# Altium schematic sheet OpenBMS.SchDoc: OpenBMS Parent schematic
size 299 x 420 mm; Title2: OpenBMS; Project: OpenBMS; DSN_APP_DATE: --/--/--; CHK_APP_DATE: --/--/--; ApprovedBy: 1; CheckedBy: 1; Author: Kayoum Djedidi; CompanyName: ISIMM; DrawnBy: Kayoum Djedidi; DocumentNumber: 1; Revision: 0; SheetNumber: 1; SheetTotal: 5; ImagePath: 1
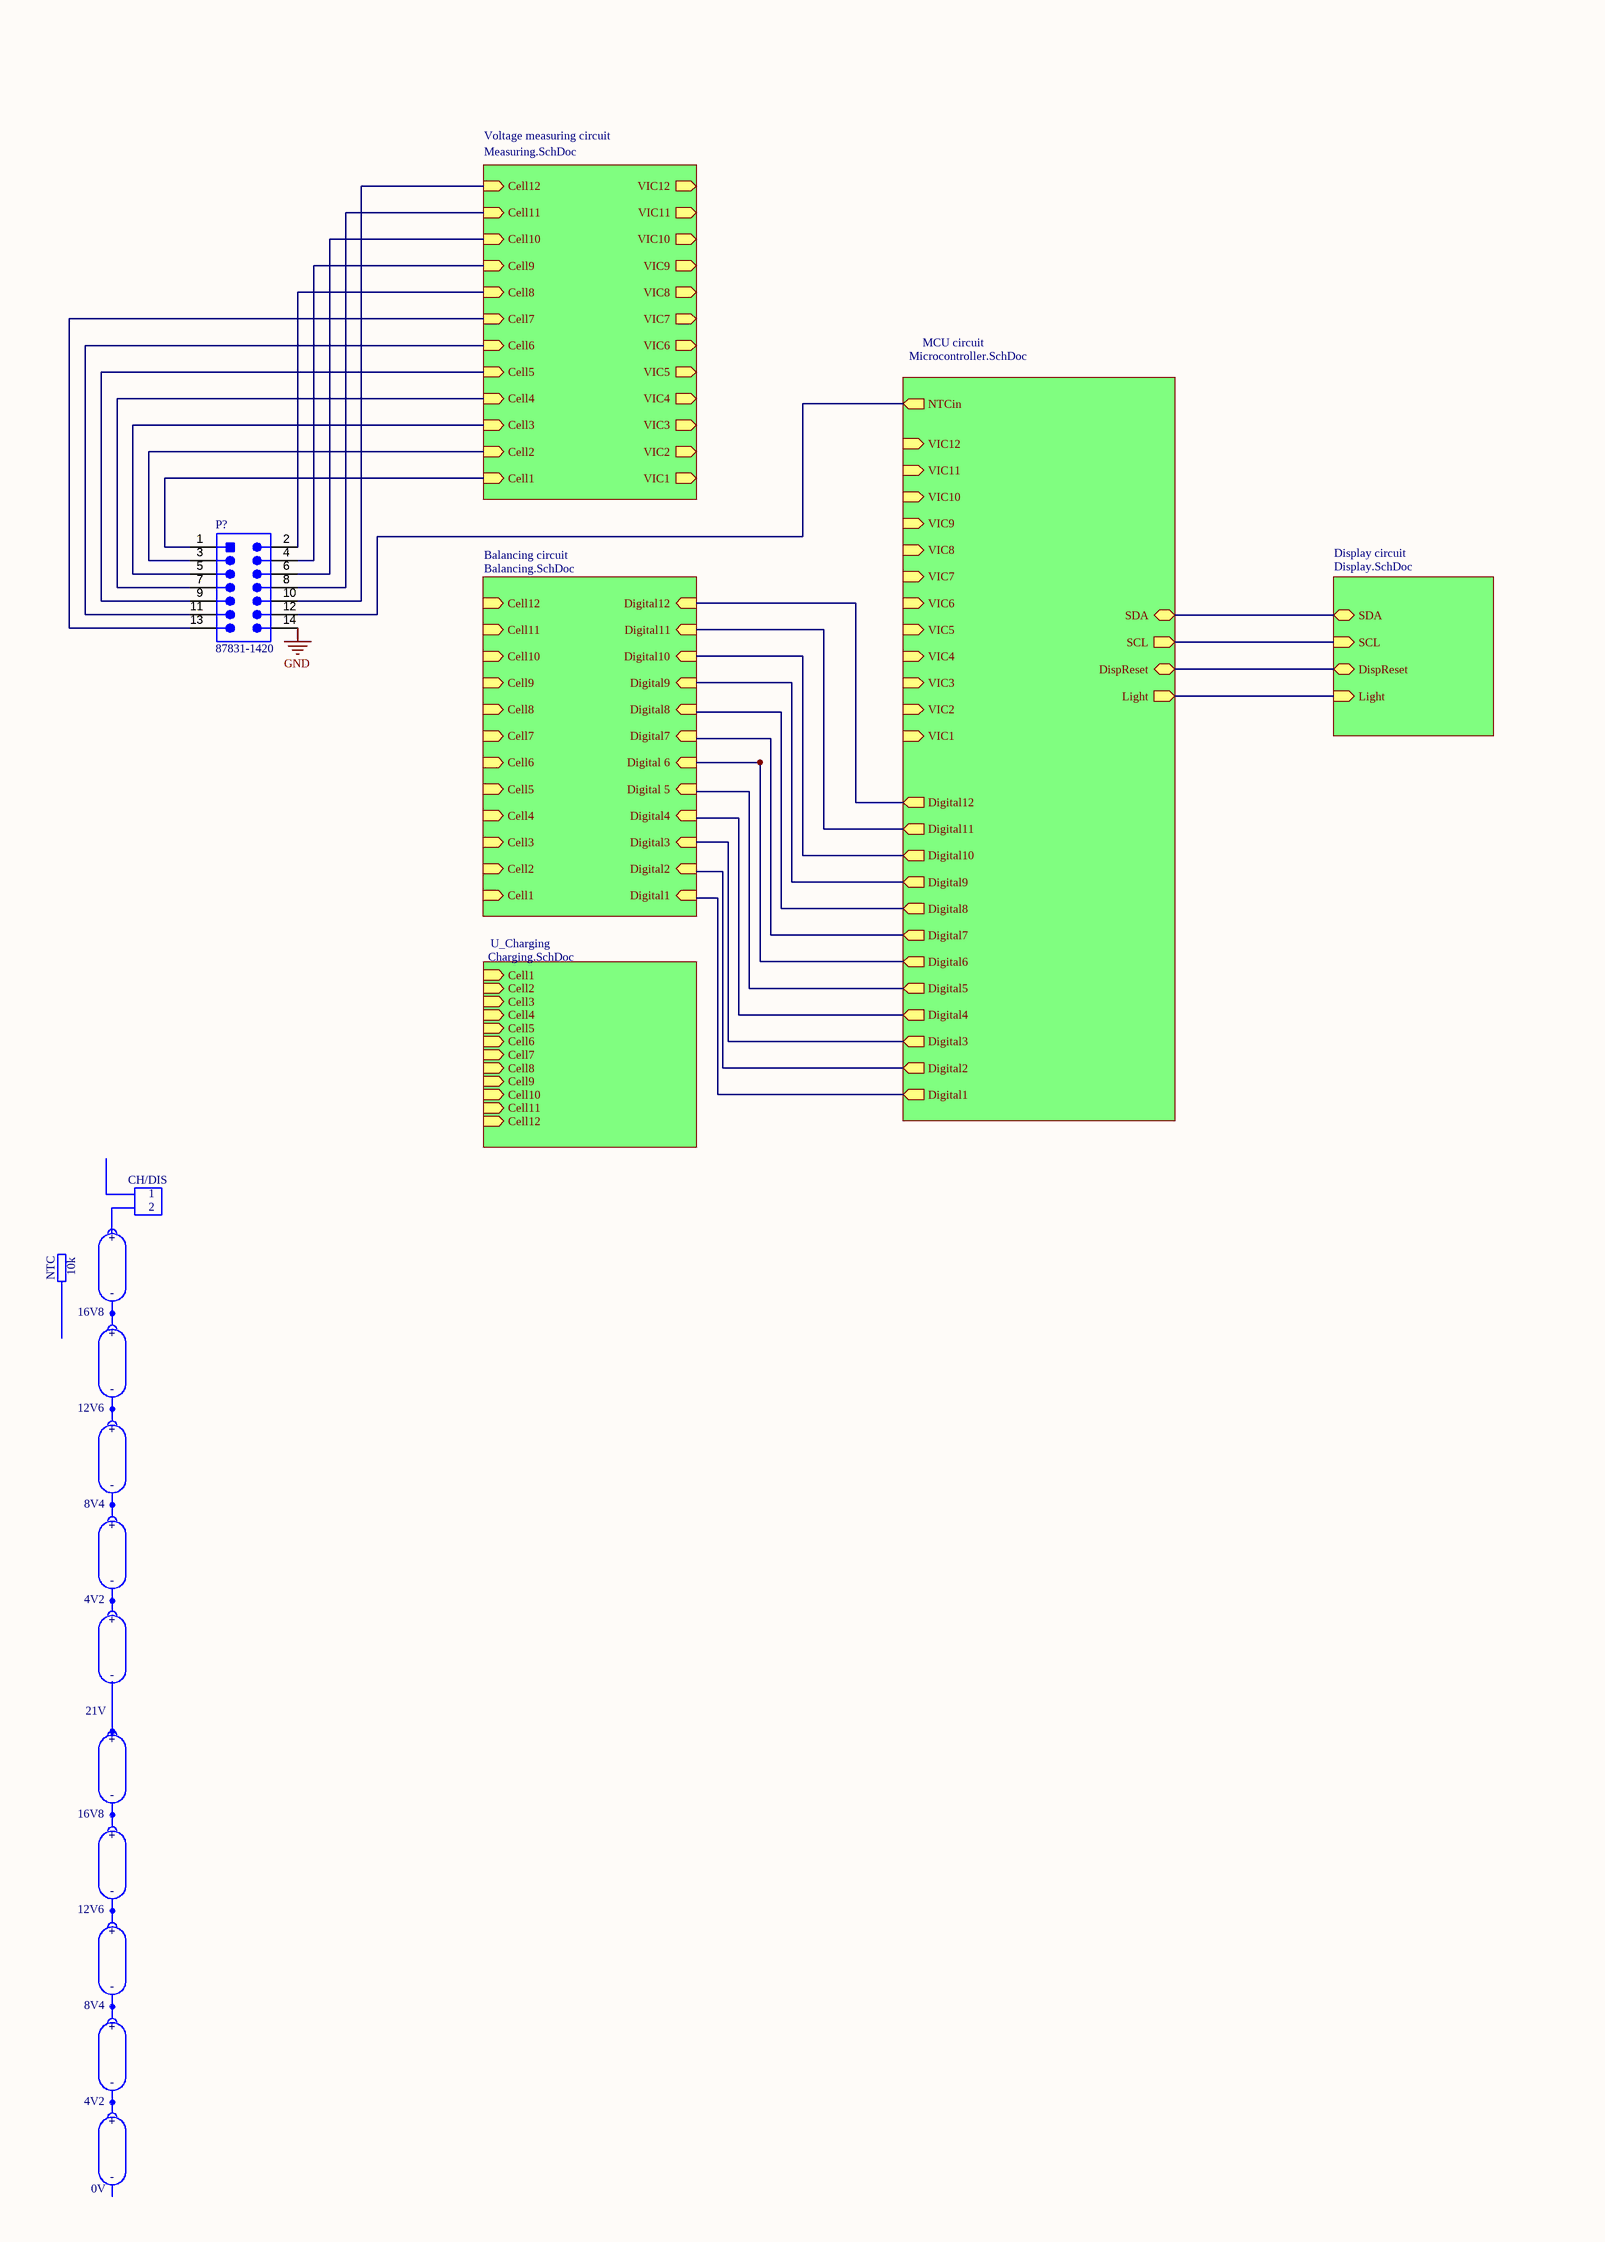
[diagram p0: OpenBMS.SchDoc]

## Parts
P?  87831-1420  [MOLEX-87831-1420_V]

## Sub-sheets
Balancing circuit = Balancing.SchDoc: Cell1 (in), Cell2 (in), Cell3 (in), Cell4 (in), Cell5 (in), Digital 5 (in), Digital4 (in), Digital3 (in), Digital2 (in), Digital1 (in), Cell6 (in), Digital 6 (in), Cell7 (in), Digital7 (in), Cell8 (in), Digital8 (in), Cell9 (in), Digital9 (in), Cell10 (in), Digital10 (in), Cell11 (in), Digital11 (in), Cell12 (in), Digital12 (in)
Display circuit = Display.SchDoc: Light (in), DispReset (bidir), SCL (in), SDA (bidir)
MCU circuit = Microcontroller.SchDoc: VIC5 (in), VIC4 (in), VIC3 (in), VIC2 (in), VIC1 (in), Digital5 (out), Digital4 (out), Digital3 (out), Digital2 (out), Digital1 (out), SDA (bidir), SCL (out), DispReset (bidir), Light (out), NTCin (out), Digital10 (out), Digital9 (out), Digital8 (out), Digital7 (out), Digital6 (out), VIC10 (in), VIC9 (in), VIC8 (in), VIC7 (in), VIC6 (in), VIC11 (in), VIC12 (in), Digital11 (out), Digital12 (out)
U_Charging = Charging.SchDoc: Cell1 (in), Cell2 (in), Cell3 (in), Cell4 (in), Cell5 (in), Cell6 (in), Cell7 (in), Cell8 (in), Cell9 (in), Cell10 (in), Cell11 (in), Cell12 (in)
Voltage measuring circuit = Measuring.SchDoc: Cell5 (in), Cell4 (in), Cell3 (in), Cell2 (in), Cell1 (in), VIC5 (out), VIC4 (out), VIC3 (out), VIC2 (out), VIC1 (out), Cell6 (in), VIC6 (out), Cell8 (in), Cell9 (in), Cell10 (in), Cell11 (in), VIC8 (out), VIC9 (out), VIC10 (out), VIC11 (out), Cell7 (in), Cell12 (in), VIC12 (out), VIC7 (out)

## Nets
GND: P?.14
NetP?_1: P?.1 ; sheet Voltage measuring circuit/Cell1
NetP?_2: P?.2 ; sheet Voltage measuring circuit/Cell8
NetP?_3: P?.3 ; sheet Voltage measuring circuit/Cell2
NetP?_4: P?.4 ; sheet Voltage measuring circuit/Cell9
NetP?_5: P?.5 ; sheet Voltage measuring circuit/Cell3
NetP?_6: P?.6 ; sheet Voltage measuring circuit/Cell10
NetP?_7: P?.7 ; sheet Voltage measuring circuit/Cell4
NetP?_8: P?.8 ; sheet Voltage measuring circuit/Cell11
NetP?_9: P?.9 ; sheet Voltage measuring circuit/Cell5
NetP?_10: P?.10 ; sheet Voltage measuring circuit/Cell12
NetP?_11: P?.11 ; sheet Voltage measuring circuit/Cell6
NetP?_12: P?.12 ; sheet MCU circuit/NTCin
NetP?_13: P?.13 ; sheet Voltage measuring circuit/Cell7
(unnamed): sheet Balancing circuit/Digital3, sheet MCU circuit/Digital3
(unnamed): sheet Balancing circuit/Digital 6, sheet MCU circuit/Digital6
(unnamed): sheet Balancing circuit/Digital9, sheet MCU circuit/Digital9
(unnamed): sheet Balancing circuit/Digital10, sheet MCU circuit/Digital10
(unnamed): sheet Balancing circuit/Digital11, sheet MCU circuit/Digital11
(unnamed): sheet Balancing circuit/Digital12, sheet MCU circuit/Digital12
(unnamed): sheet MCU circuit/SDA, sheet Display circuit/SDA
(unnamed): sheet MCU circuit/SCL, sheet Display circuit/SCL
(unnamed): sheet MCU circuit/DispReset, sheet Display circuit/DispReset
(unnamed): sheet MCU circuit/Light, sheet Display circuit/Light

## Notes on the sheet
- CH/DIS
- +
- 1
- 2
- NTC
- 16V8
- 10k
- -
- 12V6
- 8V4
- 4V2
- 21V
- 0V
- THIS DOCUMENT AND THE DATA DISCLOSED HEREIN OR
- HEREWITH IS THE PROPERTY OF ALTIUM LIMITED AND MAY
- DWG NO:
- REVISION
- REV:
- DESCRIPTION
- DATE
- APPROVED
- BE FREELY DISTRIBUTED IN WHOLE. NO RIGHTS ARE
- RESERVED OR EXPRESS OR IMPLIED WARANTEE GIVEN.
- ENG:
- APPROVALS
- PROJECT
- DSN:
- CHK:
- REFERENCE DOCUMENTS
- PROJECT REVISION:
- TITLE
- DOCUMENT REVISION:
- DESIGN ITEM:
- BOM:
- FAB DWG:
- PCB DWG:
- ASSY DWG:
- SCALE:
- A3
- SIZE
- CAGE CODE
- FILE NAME
- DWG NO.
- SHEET
- OF
- REV

## Library data of the parts
P? = CMP-2000-05240-1: Header, Pitch 2 mm, 2 x 7 Position, Height 6.4 mm, Tail Length 2.5 mm, -55 to 105 degC, RoHS, Tube; Number of Positions / Contacts: 14; Current Rating: 2A; Brand: Molex; Mounting Angle: Vertical; Pitch: 2mm; Voltage Rating: 125V; Datasheet Version: Rev. E, 04/2006; Housing Material: Thermoplastic; Contact Material: Brass; Datasheet URL: https://datasheet.ciiva.com/27096/1934585-27096088.pdf; Type: Shrouded; Number of Positions: 14; Mounting Style: ThroughHole; Product Category: Headers&WireHousings; RoHS: Details; Factory Pack Quantity: 3200; Contact Plating: Gold; Series: 87831; Number of Rows: 2; Manufacturer: Molex; Product Type: Headers; Termination Style: ThroughHole; Packaging: Tube; Tradename: Milli-Grid; Manufacturer URL: http://www.molex.com/